# EAGLE design esplash (EAGLE 9.6.2)
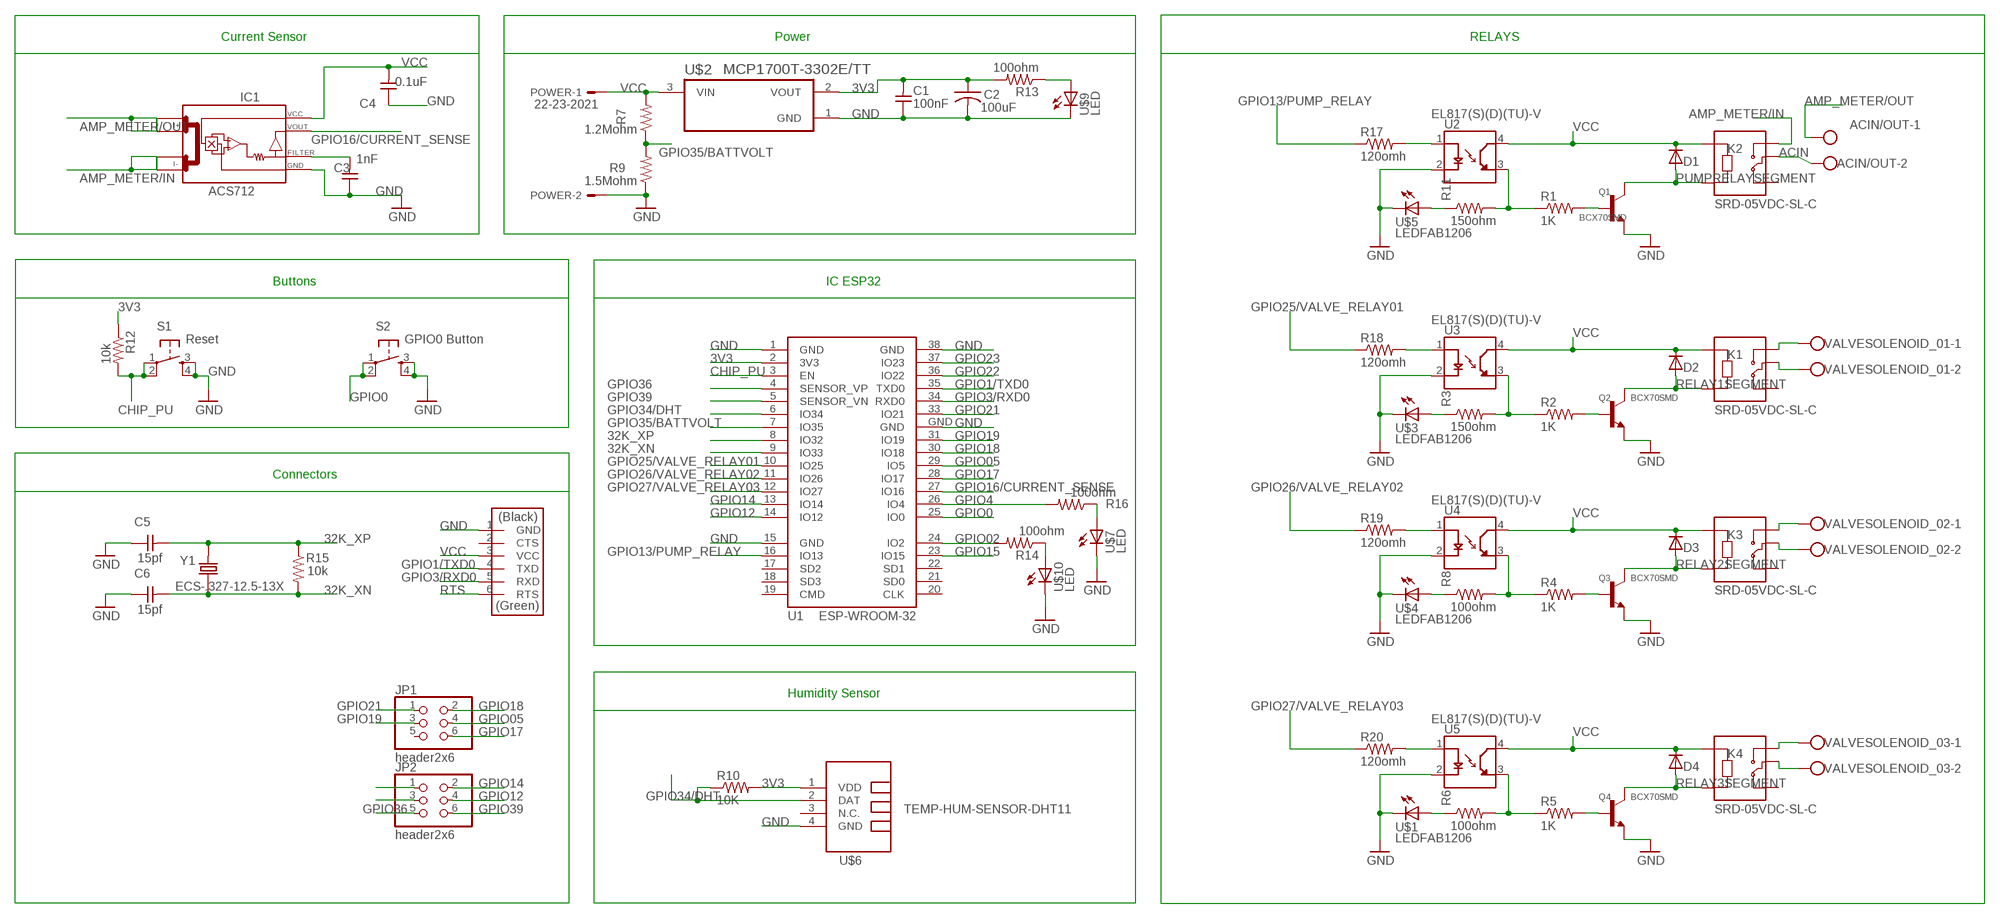
[diagram p0: schematic, sheet 1]

## Parts
ACIN/OUT  W237-102  [W237-102]
C1  100nF  CAP-UNPOLARIZEDFAB  [C1206FAB]
C2  100uF  CAP-US1206FAB  [C1206FAB]
C3  1nF  CAP-UNPOLARIZEDFAB  [C1206FAB]
C4  0.1uF  CAP-UNPOLARIZEDFAB  [C1206FAB]
C5  15pf  CAP-UNPOLARIZEDFAB  [C1206FAB]
C6  15pf  CAP-UNPOLARIZEDFAB  [C1206FAB]
D1  DIODESOD123  [SOD123]
D2  DIODESOD123  [SOD123]
D3  DIODESOD123  [SOD123]
D4  DIODESOD123  [SOD123]
IC1  ACS712  [SO08]
JP1  header2x6  PINHD-2X3  [2X03]
JP2  header2x6  PINHD-2X3  [2X03]
K1  SRD-05VDC-SL-C  [RELAY_SRD-05VDC-SL-C]
K2  SRD-05VDC-SL-C  [RELAY_SRD-05VDC-SL-C]
K3  SRD-05VDC-SL-C  [RELAY_SRD-05VDC-SL-C]
K4  SRD-05VDC-SL-C  [RELAY_SRD-05VDC-SL-C]
POWER  22-23-2021  [22-23-2021]
Q1  BCX70SMD  [SOT23]
Q2  BCX70SMD  [SOT23]
Q3  BCX70SMD  [SOT23]
Q4  BCX70SMD  [SOT23]
R1  1K  RES-US1206FAB  [R1206FAB]
R2  1K  RES-US1206FAB  [R1206FAB]
R3  150ohm  RES-US1206FAB  [R1206FAB]
R4  1K  RES-US1206FAB  [R1206FAB]
R5  1K  RES-US1206FAB  [R1206FAB]
R6  100ohm  RES-US1206FAB  [R1206FAB]
R7  1.2Mohm  RES-US1206FAB  [R1206FAB]
R8  100ohm  RES-US1206FAB  [R1206FAB]
R9  1.5Mohm  RES-US1206FAB  [R1206FAB]
R10  10K  RES-US1206FAB  [R1206FAB]
R11  150ohm  RES-US1206FAB  [R1206FAB]
R12  10k  RES-US1206  [R1206]
R13  100ohm  RES-US1206  [R1206]
R14  100ohm  RES-US1206  [R1206]
R15  10k  RES-US1206  [R1206]
R16  100ohm  RES-US1206  [R1206]
R17  120omh  RES-US1206FAB  [R1206FAB]
R18  120omh  RES-US1206FAB  [R1206FAB]
R19  120omh  RES-US1206FAB  [R1206FAB]
R20  120omh  RES-US1206FAB  [R1206FAB]
RTS  FTDI-SMD-HEADER  [1X06SMD]
S1  Reset  6MM_SWITCH6MM_SWITCH  [6MM_SWITCH]
S2  GPIO0 Button  6MM_SWITCH6MM_SWITCH  [6MM_SWITCH]
U1  ESP-WROOM-32  [ESP-WROOM-32]
U2  EL817(S)(D)(TU)-V  [SOIC254P1030X460-4N]
U3  EL817(S)(D)(TU)-V  [SOIC254P1030X460-4N]
U4  EL817(S)(D)(TU)-V  [SOIC254P1030X460-4N]
U5  EL817(S)(D)(TU)-V  [SOIC254P1030X460-4N]
U$1  LEDFAB1206  [LED1206FAB]
U$2  MCP1700T-3302E/TT  [SOT95P237X112-3N]
U$3  LEDFAB1206  [LED1206FAB]
U$4  LEDFAB1206  [LED1206FAB]
U$5  LEDFAB1206  [LED1206FAB]
U$6  TEMP-HUM-SENSOR-DHT11  [TEMP-HUM-SENSOR-DHT11]
U$7  LED  [LED1206]
U$9  LED  [LED1206]
U$10  LED  [LED1206]
VALVESOLENOID_01  W237-102  [W237-102]
VALVESOLENOID_02  W237-102  [W237-102]
VALVESOLENOID_03  W237-102  [W237-102]
Y1  ECS-.327-12.5-13X  [XTAL_ECS-.327-12.5-13X]

## Nets
3V3: C1.2 C2.1 R10.2 R12.1 R13.2 U1.2(3V3) U$2.2(VOUT) U$6.1(VDD)
32K_XN: C6.2 R15.2 U1.9(IO33) Y1.1
32K_XP: C5.2 R15.1 U1.8(IO32) Y1.2
ACIN: ACIN/OUT.2 K2.COM
AMP_METER/IN: IC1.3(I-_0) IC1.4(I-_1) K2.NO
AMP_METER/OUT: ACIN/OUT.1 IC1.1(I+_0) IC1.2(I+_1)
CHIP_PU: R12.2 S1.1(P) S1.2(P1) U1.3(EN)
DELETE: C3.2 IC1.6(FILTER)
GND: C1.1 C2.2 C3.1 C4.1 C5.1 C6.1 IC1.5(GND) POWER.2 Q1.2(E) Q2.2(E) Q3.2(E) Q4.2(E) R9.1 RTS.1(GND) S1.3(S) S1.4(S1) S2.3(S) S2.4(S1) U1.1(GND) U1.15(GND) U1.38(GND) U1.GND U2.2(C) U3.2(C) U4.2(C) U5.2(C) U$1.2(C) U$2.1(GND) U$3.2(C) U$4.2(C) U$5.2(C) U$6.4(GND) U$7.2(C) U$9.2(C) U$10.2(C)
GPIO0: S2.1(P) S2.2(P1) U1.25(IO0)
GPIO1/TXD0: RTS.4(TXD) U1.35(TXD0)
GPIO02: R14.2 U1.24(IO2)
GPIO3/RXD0: RTS.5(RXD) U1.34(RXD0)
GPIO4: R16.2 U1.26(IO4)
GPIO05: JP1.4 U1.29(IO5)
GPIO12: JP2.4 U1.14(IO12)
GPIO13/PUMP_RELAY: R17.1 U1.16(IO13)
GPIO14: JP2.2 U1.13(IO14)
GPIO15: U1.23(IO15)
GPIO16/CURRENT_SENSE: IC1.7(VOUT) U1.27(IO16)
GPIO17: JP1.6 U1.28(IO17)
GPIO18: JP1.2 U1.30(IO18)
GPIO19: JP1.3 U1.31(IO19)
GPIO21: JP1.1 U1.33(IO21)
GPIO22: U1.36(IO22)
GPIO23: U1.37(IO23)
GPIO25/VALVE_RELAY01: R18.1 U1.10(IO25)
GPIO26/VALVE_RELAY02: R19.1 U1.11(IO26)
GPIO27/VALVE_RELAY03: R20.1 U1.12(IO27)
GPIO34/DHT: R10.1 U1.6(IO34) U$6.2(DAT)
GPIO35/BATTVOLT: R7.1 R9.2 U1.7(IO35)
GPIO36: JP2.5 U1.4(SENSOR_VP)
GPIO39: JP2.6 U1.5(SENSOR_VN)
N$2: R1.1 R11.2 U2.3(ET)
N$5: K1.COM VALVESOLENOID_01.2
N$7: Q2.1(B) R2.2
N$8: R11.1 U$5.1(A)
N$10: R14.1 U$10.1(A)
N$12: K1.NO VALVESOLENOID_01.1
N$13: R3.1 U$3.1(A)
N$14: R2.1 R3.2 U3.3(ET)
N$15: K3.COM VALVESOLENOID_02.2
N$16: Q3.1(B) R4.2
N$17: R8.1 U$4.1(A)
N$18: R4.1 R8.2 U4.3(ET)
N$19: K3.NO VALVESOLENOID_02.1
N$20: K4.COM VALVESOLENOID_03.2
N$21: Q4.1(B) R5.2
N$22: R6.1 U$1.1(A)
N$23: R5.1 R6.2 U5.3(ET)
N$24: K4.NO VALVESOLENOID_03.1
N$25: R13.1 U$9.1(A)
N$27: JP2.1
N$28: JP2.3
N$29: R16.1 U$7.1(A)
N$30: R17.2 U2.1(A)
N$31: R18.2 U3.1(A)
N$32: R19.2 U4.1(A)
N$33: R20.2 U5.1(A)
N$43: Q1.1(B) R1.2
PUMPRELAYSEGMENT: D1.ANODE(A) K2.A2 Q1.3(C)
RELAY1SEGMENT: D2.ANODE(A) K1.A2 Q2.3(C)
RELAY2SEGMENT: D3.ANODE(A) K3.A2 Q3.3(C)
RELAY3SEGMENT: D4.ANODE(A) K4.A2 Q4.3(C)
RTS: RTS.6(RTS)
VCC: C4.2 D1.CATHODE(C) D2.CATHODE(C) D3.CATHODE(C) D4.CATHODE(C) IC1.8(VCC) K1.A1 K2.A1 K3.A1 K4.A1 POWER.1 R7.2 RTS.3(VCC) U2.4(CT) U3.4(CT) U4.4(CT) U5.4(CT) U$2.3(VIN)
Unconnected: JP1.5 K1.NC K2.NC K3.NC K4.NC RTS.2(CTS) U1.17(SD2) U1.18(SD3) U1.19(CMD) U1.20(CLK) U1.21(SD0) U1.22(SD1) U$6.3(N.C.)

## Notes on the sheet
- Current Sensor | Power | RELAYS
- Buttons | IC ESP32
- Connectors
- Humidity Sensor

## Library data of the parts
ACIN/OUT VALVESOLENOID_01-VALVESOLENOID_03 = con-wago-500:W237-102: WAGO SCREW CLAMP; MPN: 237-102; OC_FARNELL: unknown; OC_NEWARK: 70K9898
C1 C3-C6 = fab:CAP-UNPOLARIZED
C2 = fab:CAP-US
D1-D4 = fab:DIODE: DIODE high speed (Philips)
IC1 = ACS712:ACS712
JP1 JP2 = pinhead:PINHD-2X3: PIN HEADER
K1-K4 = SRD-05VDC-SL-C:SRD-05VDC-SL-C: 5V Trigger Relay Module For Arduino And Raspberry Pi 5V Trigger Relay Module For Arduino And Raspberry Pi; AVAILABILITY: Unavailable; DESCRIPTION: 5V Trigger Relay Module For Arduino And Raspberry Pi 5V Trigger Relay Module For Arduino And Raspberry Pi; MF: Songle Relay; MP: SRD-05VDC-SL-C; PACKAGE: None; PRICE: None
POWER = con-molex:22-23-2021: .100" (2.54mm) Center Header - 2 Pin; MF: MOLEX; MPN: 22-23-2021; OC_FARNELL: 1462926; OC_NEWARK: 25C3832
Q1-Q4 = transistor:BCX70SMD: NPN TRANSISTOR
R1-R20 = fab:RES-US: Resistor (US Symbol) Variants with postfix FAB are widened to allow the routing of internal traces
RTS = fab:FTDI-SMD-HEADER
S1 S2 = fab:6MM_SWITCH: OMRON SWITCH
U1 = esp32:ESP-WROOM-32: Espressif Systems ESP-WROOM-32
U2-U5 = EL817_S__D__TU_-V:EL817(S)(D)(TU)-V: Optocoupler DC-IN 1-CH Transistor DC-OUT 4-Pin PDIP Tube; AVAILABILITY: Unavailable; DESCRIPTION: Optoisolator Transistor Output 5000Vrms 1 Channel 4-SMD; MF: Everlight Electronics; MP: EL817(S)(D)(TU)-V; PACKAGE: SMD-4 Everlight; PRICE: None
U$1 U$3-U$5 U$7 U$9 U$10 = fab:LED: LED
U$2 = MCP1700T-3302E_TT:MCP1700T-3302E/TT; ARROW_AMERICAS-PURCHASE-URL: https://snapeda.com/shop?store=Arrow+Americas&id=4791194; AVAILABILITY: Unavailable; DESCRIPTION: IC REG LINEAR 3.3V 250MA SOT23-3; DIGIKEY-PURCHASE-URL: https://snapeda.com/shop?store=DigiKey&id=4791194; MF: Microchip Technology; MOUSER-PURCHASE-URL: https://snapeda.com/shop?store=Mouser&id=4791194; MP: MCP1700T-3302E/TT; PACKAGE: None; PRICE: None
U$6 = diy-modules:TEMP-HUM-SENSOR-DHT11: DHT11 - digital humidity & temperature sensor DHT11 datasheet available here: https://akizukidenshi.com/download/ds/aosong/DHT11.pdf Click here to find device on ebay.com <http://www.ebay.com/sch/dht11+digital+sensor>
Y1 = ECS-.327-12.5-13X:ECS-.327-12.5-13X: Crystal Cylindrical Can, Radial; AVAILABILITY: Unavailable; DESCRIPTION: 32.768kHz ±20ppm Crystal 12.5pF 35 kOhms Cylindrical Can, Radial; MF: ECS Inc.; MP: ECS-.327-12.5-13X; PACKAGE: Cylindrical Can Radial ECS International; PRICE: None

## Board
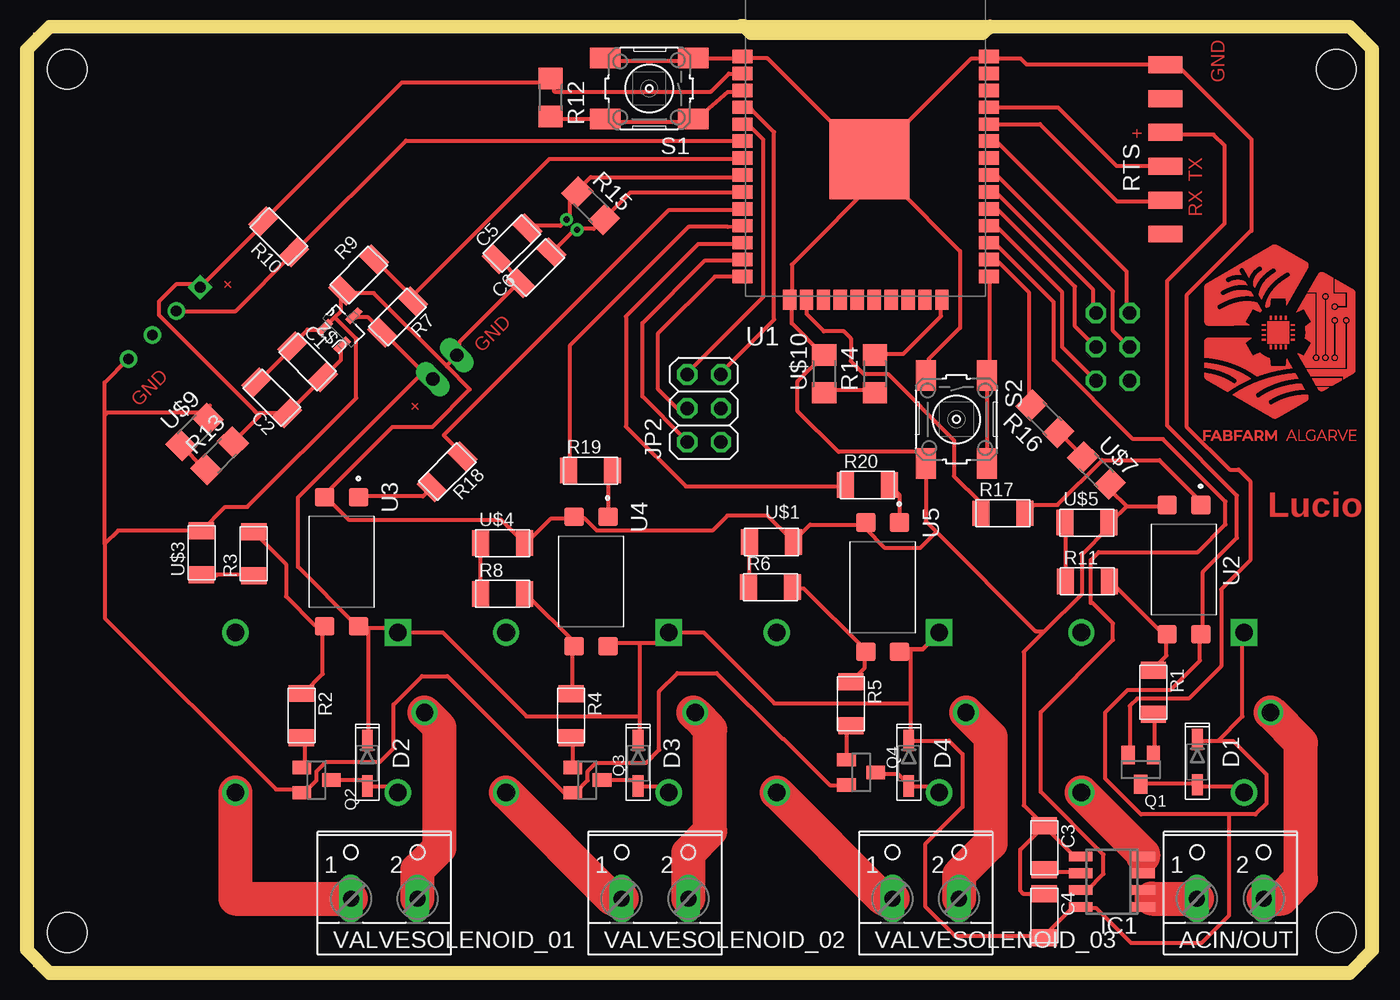
[diagram p1: board, top side]
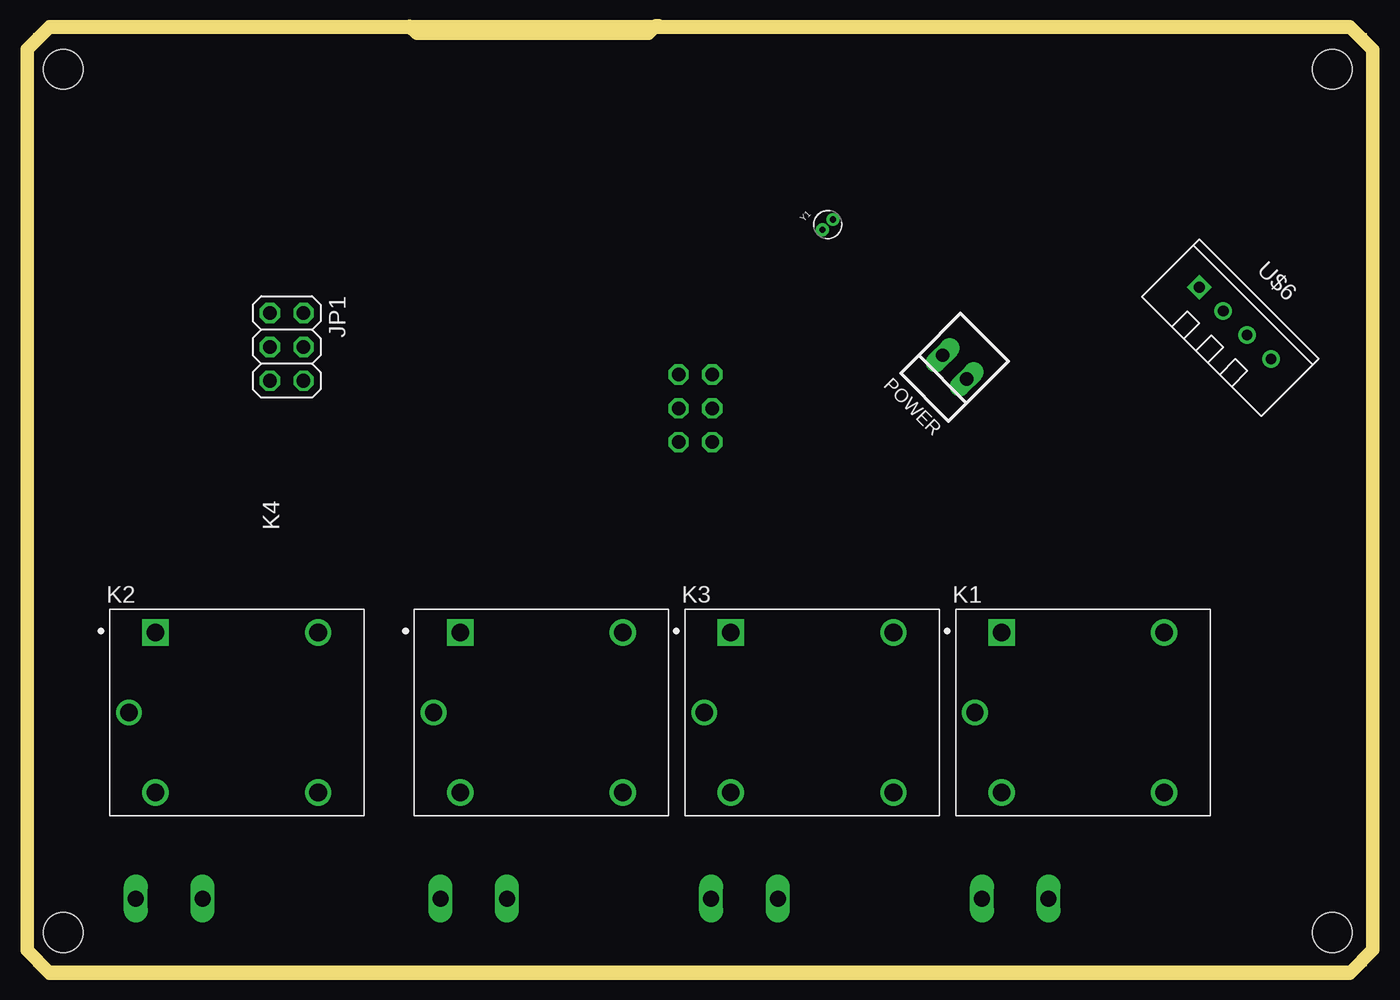
[diagram p2: board, bottom side, seen from below]

Size 100 x 70 mm. Coordinates in mm from the lower left corner, seen from the top.
Outline: 0,0 100,0 100,70 0,70 0,0
Copper layers (1*16): Top 0.035mm / dielectric 1.5mm / Bottom 0.035mm
Design rules "default *": minimum track width 12mil, minimum drill 0.35mm, track to track 6mil, track to pad 6mil, pad to pad 6mil, via to via 6mil, smd to smd 6mil, copper to edge 40mil, drill to drill 6mil, minimum pad ring 10mil, minimum via ring 8mil, stop-mask expansion 4mil, vias tented up to drill 0mil, thermal gap 10mil
Holes 3 mm at 2.54,67.31 97.79,67.31 97.79,2.54 2.54,2.54
Milling: 12 lines

### Footprints (pad centres in the part's own frame; a part is rotated, then mirrored left to right if it is on the bottom)
W237-102 = drill 1.194 long: 1 -2.5,-1.27; 2 2.5,-1.27
C1206FAB = smd 1.27 x 1.905: 1 -1.651,0; 2 1.651,0
SOD123 = smd 1.6 x 0.8: ANODE 1.7,0; CATHODE -1.7,0
SO08 = smd 0.72 x 1.78: 1 -1.905,-2.35; 2 -0.635,-2.35; 3 0.635,-2.35; 4 1.905,-2.35; 5 1.905,2.35; 6 0.635,2.35; 7 -0.635,2.35; 8 -1.905,2.35
2X03 = drill 1.016 octagon: 1 -2.54,-1.27; 2 -2.54,1.27; 3 0,-1.27; 4 0,1.27; 5 2.54,-1.27; 6 2.54,1.27
RELAY_SRD-05VDC-SL-C = drill 1.32 square: A1 -6.1,6 | drill 1.32: A2 -6.1,-6; NC 6.1,6; NO 6.1,-6 | drill 1.29: COM -8.1,0
22-23-2021 = drill 1 long: 1 -1.27,0; 2 1.27,0
SOT23 = smd 1 x 1.4: 1 -0.95,-1.1; 2 0.95,-1.1; 3 0,1.1
R1206FAB = smd 1.27 x 1.905: 1 -1.651,0; 2 1.651,0
R1206 = smd 1.6 x 1.803: 1 -1.422,0; 2 1.422,0
1X06SMD = smd 2.54 x 1.27: 1 0,6.35; 2 0,3.81; 3 0,1.27; 4 0,-1.27; 5 0,-3.81; 6 0,-6.35
6MM_SWITCH = smd 2.286 x 1.524: 1 -3.302,2.286; 2 3.302,2.286; 3 -3.302,-2.286; 4 3.302,-2.286
ESP-WROOM-32 = smd 1.5 x 1: 1 -9.25,7; 2 -9.25,5.73; 3 -9.25,4.46; 4 -9.25,3.19; 5 -9.25,1.92; 6 -9.25,0.65; 7 -9.25,-0.62; 8 -9.25,-1.89; 9 -9.25,-3.16; 10 -9.25,-4.43; 11 -9.25,-5.7; 12 -9.25,-6.97; 13 -9.25,-8.24; 14 -9.25,-9.51; 25 9.25,-9.51; 26 9.25,-8.24; 27 9.25,-6.97; 28 9.25,-5.7; 29 9.25,-4.43; 30 9.25,-3.16; 31 9.25,-1.89; 32 9.25,-0.62; 33 9.25,0.65; 34 9.25,1.92; 35 9.25,3.19; 36 9.25,4.46; 37 9.25,5.73; 38 9.25,7 | smd 1 x 1.5: 15 -5.7,-11.25; 16 -4.43,-11.25; 17 -3.16,-11.25; 18 -1.89,-11.25; 19 -0.62,-11.25; 20 0.65,-11.25; 21 1.92,-11.25; 22 3.19,-11.25; 23 4.46,-11.25; 24 5.73,-11.25 | smd 6 x 6: GND 0.3,-0.7
SOIC254P1030X460-4N = smd 1.41 x 1.47: 1 -4.85,1.27; 2 -4.85,-1.27; 3 4.85,-1.27; 4 4.85,1.27
LED1206FAB = smd 1.27 x 1.905: 1 -1.651,0; 2 1.651,0
SOT95P237X112-3N = smd 1.321 x 0.559: 1 -1.092,0.94; 2 -1.092,-0.94 | smd 1.321 x 0.508: 3 1.092,0
TEMP-HUM-SENSOR-DHT11 = drill 0.8 square: 1 -3.81,0 | drill 0.8: 2 -1.27,0; 3 1.27,0; 4 3.81,0
LED1206 = smd 1.6 x 1.803: 1 -1.422,0; 2 1.422,0
XTAL_ECS-.327-12.5-13X = drill 0.46 pad 0.86: 1 -0.55,0; 2 0.55,0

### Placement (x,y rotation side)
ACIN/OUT  89.84,6.35 0 top
C1  20.59,45.35 315 top
C2  17.9,42.66 135 top
C3  75.87,8.89 270 top
C4  75.87,3.81 270 top
C5  35.92,54.22 45 top
C6  37.71,52.43 45 top
D1  87.36,15.32 270 top
D2  25.07,15.24 270 top
D3  45.39,15.24 270 top
D4  65.71,15.24 270 top
IC1  80.95,6.35 90 top
JP1  81.02,46.47 270 bottom
JP2  50.34,41.87 90 top
K1  21.26,19.05 0 bottom
K2  84.76,19.05 0 bottom
K3  41.58,19.05 0 bottom
K4  61.9,19.05 0 bottom
POWER  30.89,44.95 135 bottom
Q1  83.11,14.76 180 top
Q2  21.26,13.97 270 top
Q3  41.58,13.97 270 top
Q4  62.13,14.55 270 top
R1  84.06,20.56 270 top
R2  20.12,18.82 270 top
R3  16.55,30.95 90 top
R4  40.36,18.81 270 top
R5  61.37,19.71 270 top
R6  55.32,28.45 0 top
R7  27.33,48.72 225 top
R8  35.23,27.94 0 top
R9  24.42,51.87 45 top
R10  18.43,54.75 135 top
R11  79.11,28.88 0 top
R12  38.84,65.19 270 top
R13  13.98,38.31 45 top
R14  63.17,44.45 90 top
R15  41.83,57.07 315 top
R16  75.91,41.09 135 top
R17  220omh  [R1206FAB]  72.77,34 0 top
R18  220omh  [R1206FAB]  31.06,37.11 225 top
R19  220omh  [R1206FAB]  41.81,37.2 0 top
R20  220omh  [R1206FAB]  62.61,36.11 0 top
RTS  84.96,61.3 0 top
S1  46.22,65.85 180 top
S2  69.28,41.04 270 top
U1  62.46,61.26 0 top
U2  86.36,29.76 270 top
U3  23.14,30.36 270 top
U4  41.85,28.88 270 top
U5  63.75,28.45 270 top
U$1  55.39,31.84 0 top
U$2  23.28,48.05 45 top
U$3  12.62,31.03 90 top
U$4  35.23,31.75 0 top
U$5  79.08,33.3 0 top
U$6  9.83,48.26 315 bottom
U$7  79.79,37.2 315 top
U$9  12.1,40.08 45 top
U$10  59.36,44.45 90 top
VALVESOLENOID_01  26.34,6.35 0 top
VALVESOLENOID_02  46.66,6.35 0 top
VALVESOLENOID_03  66.98,6.35 0 top
Y1  40.41,55.65 45 bottom

### Tracks (layer width: path | path; a pad name or v marks a point on that pad's centre or on a via)
3V3
  Top 0.305: U1.2 53.04,66.98 52.21,66.98 50.85,65.62 39.12,65.62 38.92,66.32 | 38.92,66.32 R12.1 38.63,66.52 | U$2.2 23.09,46.41 23.09,45.49 21.95,44.35 C1.2 21.72,44.12 19.2,41.6 C2.1 16.92,41.49 16.85,41.42 16.76,41.51 | R13.2 16.98,41.31 16.96,41.33 16.77,41.52 | U$6.1 12.31,51.16 10.71,51.16 9.44,49.89 9.44,48.86 16.77,41.52 | 16.76,41.51 16.58,41.69 | 12.57,50.98 U$6.1 | 16.75,41.5 16.76,41.51 | 16.76,41.51 16.77,41.52 | U$6.1 17.26,55.69 R10.2 27.66,66.32 38.92,66.32
32K_XN
  Top 0.305: C6.2 39.09,53.72 40.69,55.32 Y1.1 40.92,55.32 42.06,55.32 42.75,56.01 R15.2 42.98,56.24 44.81,58.06 53.04,58.06 U1.9
32K_XP
  Top 0.305: C5.2 37.26,55.55 39.55,55.55 40.01,56.01 Y1.2 40.23,56.24 40.23,57.61 40.69,58.06 R15.1 40.92,58.29 41.83,59.21 53.04,59.21 U1.8
ACIN
  Top 2.54: ACIN/OUT.2 93.66,5.08 95.14,6.55 95.14,16.77 K2.COM
AMP_METER/IN
  Top 0.305: IC1.3 83.44,7.09 IC1.4
  Top 2.54: IC1.4 83.3,8.41 K2.NO
AMP_METER/OUT
  Top 0.305: IC1.1 83.44,4.57 83.93,5.08 83.44,5.71 IC1.2
  Top 2.54: 83.93,5.08 ACIN/OUT.1
CHIP_PU
  Top 0.305: R12.2 38.86,63.55 42.75,63.55 42.98,63.32 42.98,63.51 S1.2 43.09,63.32 49.38,63.32 | 49.61,63.32 49.38,63.32 | 49.18,63.16 S1.1 | 49.38,63.32 S1.1 | U1.3 53.04,65.61 52.12,65.61 49.76,63.57 49.63,63.62 S1.1
DELETE
  Top 0.305: IC1.6 78.41,7.09 75.9,7.09 C3.2
GND
  Top 0.305: C2.2 16.92,43.89 19.43,46.41 C1.1 19.43,46.63 20.57,47.78 21.72,47.78 U$2.1 21.95,48.01 22.63,48.69 | C5.1 34.98,53.03 36.58,51.44 C6.1 36.35,51.21 32,46.86 32,45.95 POWER.2 | U$3.2 12.35,32.41 | S1.3 50.05,68.14 50.06,68.12 53.04,68.12 U1.1 53.26,68.12 55.09,68.12 62.64,60.58 U1.GND | 49.61,67.89 49.15,67.89 | 49.15,67.89 43.09,67.89 S1.4 | 49.18,67.73 S1.3 | U1.GND 62.87,60.58 70.41,68.12 71.55,68.12 U1.38 71.78,68.12 74.09,68.12 74.55,67.67 84.81,67.67 RTS.1 85.84,67.65 91.43,62.05 91.43,55.23 | 63.74,59.47 62.87,60.35 U1.GND | 63.74,59.47 64.69,58.52 | 64.69,58.52 69.55,53.67 69.55,47.91 67.21,45.57 67.21,44.35 S2.3 | 63.74,59.47 56.92,52.65 56.92,50.06 U1.15 56.92,49.84 56.92,48.23 59.21,45.95 U$10.2 57.37,43.88 57.37,41.65 60.43,38.59 66.94,38.59 S2.4 66.98,37.72 66.98,33.38 67.77,32.59 | 64.69,58.52 U1.GND | 61.04,13.37 61.04,13.49 Q4.2 59.78,13.6 56.32,17.06 56.23,17.06 51.29,22 48.35,22 46.98,20.64 46.98,16.25 46.01,15.27 42.25,15.27 41.61,14.63 41.61,13.95 40.69,13.03 Q3.2 40.46,13.03 39.82,13.03 31.08,21.77 29.17,21.77 27.04,19.64 27.04,16.34 26.03,15.33 21.96,15.33 21.26,14.63 21.26,13.95 20.34,13.02 Q2.2 20.07,13.28 18.22,13.28 5.37,26.13 5.37,31.7 | 82.07,34.52 85.04,34.52 U2.2 | 82.07,34.52 80.92,33.38 U$5.2 80.61,32.82 78.68,30.89 78.68,27.93 75.9,25.15 | 82.07,34.52 80.92,35.66 80.92,36.12 U$7.2 | C3.1 74.09,8.76 74.05,8.76 74.05,5.69 74.28,5.46 C4.1 | 23.09,50.51 23.09,49.15 22.63,48.69 | 23.09,50.51 23.09,50.52 R9.1 | 21.83,35.35 21.97,35.35 22.17,35.43 | 22.17,35.43 22.4,35.43 U3.2 21.95,35.43 22.17,35.43 | 21.83,35.35 26.95,40.46 29.93,40.46 32.76,43.29 31.04,45.01
  Top 0.305: POWER.2 31.04,45.1 31.04,45.01 | POWER.2 31.78,45.72 31.78,45.49 POWER.2 | 23.09,50.51 25.55,50.51 31.04,45.01 | 21.83,35.35 23.66,33.52 35.1,33.52 36.86,31.75 U$4.2 37.03,31.77 38.86,33.6 40.46,33.6 U4.2 40.69,33.6 41.38,33.6 42.29,32.69 50.96,32.69 52.09,33.82 55.11,33.82 56.92,32 U$1.2 57.15,32 58.29,33.15 62.41,33.15 U5.2 62.48,32.82 63.92,31.37 66.55,31.37 67.77,32.59 | 13.26,42.06 13.1,41.9 U$9.2 | 7.32,45.72 U$6.4 | 13.43,32.68 U$3.2 | 13.16,41.03 U$9.2 | 12.58,32.81 U$3.2 | 22.63,48.69 24.23,47.09 24.23,42.63 16.07,34.46 14.4,34.46 U$3.2 | IC1.5 78.41,8.46 77.95,8.46 75.9,10.52 C3.1 | C3.1 74.34,12.07 74.34,23.59 75.9,25.15 | Q1.2 82.3,16 82.3,19.54 82.85,20.09 86.72,20.09 89.15,22.52 89.15,28.28 91.32,30.45 91.32,36.39 90.46,37.26 89.78,37.26 86.54,40.5 86.54,50.35 91.43,55.23 | 49.15,67.89 S1.3 | 75.9,25.15 75.21,25.15 67.77,32.59 | 7.14,45.55 U$6.4 | U$3.2 6.35,32.68 5.37,31.7 | 5.37,31.7 5.36,31.71 5.36,41.35 | U$6.4 5.36,43.79 5.36,41.35 | U$9.2 12.94,41.09 13.39,41.54 5.55,41.54 5.36,41.35 | 91.43,55.23 91.43,55.17
GPIO0
  Top 0.305: U1.25 71.78,51.66 71.78,44.35 S2.1 71.55,44.12 71.55,37.95 S2.2
GPIO1/TXD0
  Top 0.305: U1.35 76.91,64.45 81.32,60.04 84.94,60.04 RTS.4
GPIO02
  Top 0.305: U1.24 68.12,49.84 68.12,48.78 65.29,45.95 63.32,45.95 R14.2
GPIO3/RXD0
  Top 0.305: U1.34 75.55,63.18 81.37,57.37 84.84,57.37 RTS.5
GPIO4
  Top 0.305: U1.26 71.78,52.81 72.47,52.81 74.75,50.52 74.75,42.29 R16.2
GPIO05
  Top 0.305: U1.29 71.78,56.69 72.47,56.69 78.17,50.99 78.17,48.02 79.55,46.63 JP1.4
GPIO12
  Top 0.305: U1.14 51.15,51.75 46.9,47.51 46.9,43.28 48.32,41.87 JP2.4
GPIO13/PUMP_RELAY
  Top 0.305: U1.16 58.03,48.94 59.33,47.65 60.82,47.65 61.35,47.12 61.35,45.4 62.32,44.44 64.13,44.44 69.1,39.47 69.1,36.83 69.13,36.75 71,34.88 71,34 R17.1
GPIO14
  Top 0.305: U1.13 53.17,52.97 50.42,52.97 45.71,48.27 45.71,42.76 48.92,39.55 JP2.2
GPIO16/CURRENT_SENSE
  Top 0.305: IC1.7 79.1,5.71 80.32,6.94 80.32,8.37 75.61,13.09 75.61,19.08 81.02,24.49 81.02,25.73 79.49,27.26 79.36,27.26 79.36,30.47 79.96,31.07 87.39,31.07 89.46,33.15 89.46,34.86 84.78,39.55 82.53,39.55 76.58,45.49 76.58,49.84 72.24,54.18 71.78,54.18 U1.27
GPIO17
  Top 0.305: U1.28 71.78,55.55 72.24,55.55 77.22,50.57 77.22,46.46 79.55,44.12 JP1.6
GPIO18
  Top 0.305: U1.30 71.78,58.06 72.24,58.06 79.55,50.75 79.55,49.15 JP1.2
GPIO19
  Top 0.305: U1.31 71.78,59.21 72.47,59.21 81.03,50.64 81.03,47.67 82.07,46.63 JP1.3
GPIO21
  Top 0.305: U1.33 71.78,61.72 72.47,61.72 82.07,52.12 82.07,49.15 JP1.1
GPIO25/VALVE_RELAY01
  Top 0.305: U1.10 53.13,56.75 47.72,56.75 30.8,39.83 32.25,38.38 R18.1
GPIO26/VALVE_RELAY02
  Top 0.305: U1.11 52.13,55.49 49.18,55.49 40.25,46.55 40.25,37.25 R19.1
GPIO27/VALVE_RELAY03
  Top 0.305: U1.12 53.04,54.18 49.89,54.18 44.48,48.77 44.48,40.5 48.98,36 60.88,36 R20.1
GPIO34/DHT
  Top 0.305: U1.6 53.04,61.95 27.96,61.95 R10.1 15.17,49.16 U$6.2
GPIO35/BATTVOLT
  Top 0.305: U1.7 53.04,60.58 38.73,60.58 28.5,50.35 R7.1 28.38,50.26 25.6,53.03 R9.2
GPIO36
  Top 0.305: U1.4 53.26,64.24 53.95,64.24 55.6,62.58 55.6,48.52 51.66,44.58 JP2.5
GPIO39
  Top 0.305: U1.5 53.26,63.09 53.72,63.09 54.8,62.02 54.8,50.23 49.15,44.58 JP2.6
N$2
  Top 0.305: 85.04,24.69 85.04,23.32 84.13,22.4 R1.1 | 85.04,24.69 80.92,28.8 R11.2 | 85.04,24.69 U2.3
N$5
  Top 2.54: VALVESOLENOID_01.2 28.84,7.25 30.48,8.89 30.48,17.93 K1.COM
N$7
  Top 0.305: Q2.1 20.35,15.09 20.35,17.14 R2.2
N$8
  Top 0.305: U$5.1 77.5,33.15 77.5,29.03 R11.1
N$10
  Top 0.305: U$10.1 59.44,43.2 63.09,43.2 R14.1
N$12
  Top 2.54: K1.NO 15.16,5.08 VALVESOLENOID_01.1
N$13
  Top 0.305: 13.75,29.34 13.75,29.38 U$3.1 16.47,29.38 R3.1
N$14
  Top 0.305: R2.1 20.35,20.57 21.72,21.95 21.72,25.38 U3.3 21.72,25.6 21.12,25.6 18.97,27.75 18.97,30.18 R3.2 16.63,32.68
N$15
  Top 0.305: K3.COM 49.84,18.97 49.72,18.86
  Top 2.54: VALVESOLENOID_02.2 49.16,8.52 50.8,10.16 50.8,17.78 49.72,18.86 49.53,19.05
N$16
  Top 0.305: Q3.1 40.46,15.09 40.46,17.14 R4.2
N$17
  Top 0.305: R8.1 U$4.1
N$18
  Top 0.305: R4.1 40.46,20.57 40.46,24 U4.3 40.69,24.23 37.03,27.89 R8.2
N$19
  Top 2.54: K3.NO 43.45,5.08 VALVESOLENOID_02.1
N$20
  Top 2.54: K4.COM 71.84,17.21 71.84,9.22 69.48,6.87 VALVESOLENOID_03.2
N$21
  Top 0.305: Q4.1 61.04,15.54 61.04,17.83 61.27,18.06 R5.2
N$22
  Top 0.305: R6.1 53.72,28.57 53.72,31.77 U$1.1
N$23
  Top 0.305: R5.1 61.49,21.49 62.41,22.4 62.41,23.55 U5.3 62.41,23.77 57.84,28.35 57.15,28.35 R6.2
N$24
  Top 2.54: K4.NO 63.77,5.08 VALVESOLENOID_03.1
N$25
  Top 0.305: R13.1 12.87,37.3 U$9.1
N$29
  Top 0.305: U$7.1 78.64,38.41 77.04,40.01 R16.1
N$30
  Top 0.305: U2.1 87.63,34.86 84.52,37.97 80.22,37.97 76.88,34.62 75.13,34.62 74.5,34 R17.2
N$31
  Top 0.305: U3.1 24.5,35.25 29.25,35.25 29.88,35.88 R18.2
N$32
  Top 0.305: U4.1 43.13,33.75 43.13,36.88 43.38,37.12 R19.2
N$33
  Top 0.305: U5.1 65,33.38 65,35.38 64.38,36 R20.2
N$43
  Top 0.305: Q1.1 84.13,16 84.13,18.75 R1.2
PUMPRELAYSEGMENT
  Top 0.305: Q1.3 83.21,13.72 87.33,13.72 D1.ANODE 87.55,13.49 90.53,13.49 90.75,13.26 K2.A2
RELAY1SEGMENT
  Top 0.305: Q2.3 22.4,13.95 24.69,13.95 24.92,13.72 D2.ANODE 25.15,13.49 26.98,13.49 27.2,13.26 K1.A2
RELAY2SEGMENT
  Top 0.305: Q3.3 42.75,13.95 45.03,13.95 45.26,13.72 D3.ANODE 45.49,13.49 47.32,13.49 47.55,13.26 K3.A2
RELAY3SEGMENT
  Top 0.305: Q4.3 63.32,14.4 64.92,14.4 65.61,13.72 D4.ANODE 65.84,13.49 67.67,13.49 67.89,13.26 K4.A2
VCC
  Top 0.305: 89.74,11.4 91.73,11.4 92.54,12.21 92.54,14.4 90.03,16.92 88.93,16.92 | 89.74,11.4 83.14,11.4 80.45,14.09 80.45,19.06 82.15,20.75 85.37,20.75 87.55,22.94 87.55,24.69 U2.4 87.78,24.92 87.78,29.59 90.34,32.14 90.34,35.32 85.1,40.56 85.1,51.42 89.41,55.73 89.41,61.57 88.58,62.41 85.04,62.41 RTS.3 | 88.93,16.92 87.55,16.92 D1.CATHODE | 89.74,11.4 89.74,3.8 87.67,1.73 82.4,1.73 79.79,4.34 78.64,4.34 IC1.8 78.41,4.34 77.95,4.34 75.9,2.29 C4.2 75.67,2.29 69.17,2.29 66.93,4.52 66.93,9.15 69.75,11.97 69.75,15.92 68.73,16.94 D4.CATHODE 65.84,17.07 65.84,19.73 | 88.93,16.92 90.75,18.75 90.75,24.92 K2.A1 | U5.4 65.15,23.77 66.72,23.77 K4.A1 | 67.89,24.92 K4.A1 | 65.84,19.73 65.84,23.77 66.75,23.77 68,25.02 K4.A1 | 45.49,24.23 46.86,24.23 47.55,24.92 K3.A1 50.3,25.05 55.62,19.73 65.84,19.73 | 45.49,24.23 43.21,24.23 U4.4 | 45.49,24.23 45.49,18.76 | 45.49,18.76 45.49,17.14 D3.CATHODE | U$2.3 24.23,48.69 25.15,48.69 26.09,47.75 R7.2 26.34,47.5 29.26,44.58 | 29.26,44.58 29.95,43.89 POWER.1 29.26,44.58 | 25.15,25.38 26.98,25.38 27.2,25.15 K1.A1 30.72,25.05 37.01,18.76 45.49,18.76 | 25.15,25.38 24.46,25.38 U3.4 24.23,25.6 19.86,29.98 19.86,35.17 29.26,44.58 | 25.15,25.38 25.15,17.14 D2.CATHODE
(copper drawn outside any net)
  shapes: Top area x14410

### Text on the board
Top: GND | + | TX | RX | + | GND | GND | + | Lucio